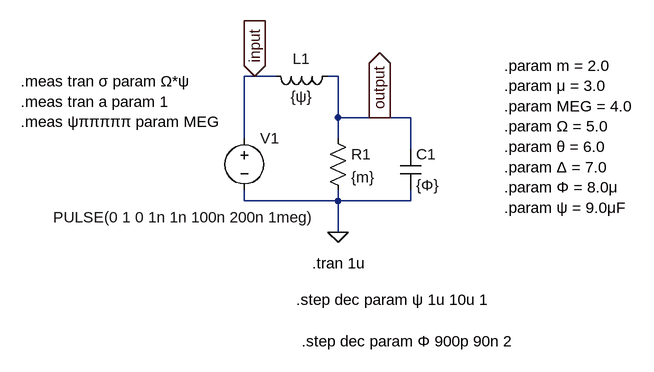
[diagram p0: schematic test17.asc]
test17.asc, the LTspice schematic file:
Version 4.1
SHEET 1 880 680
WIRE 112 48 96 48
WIRE 144 48 112 48
WIRE 240 48 224 48
WIRE 240 112 240 48
WIRE 304 112 240 112
WIRE 352 112 304 112
WIRE 96 144 96 48
WIRE 240 144 240 112
WIRE 352 160 352 112
WIRE 96 240 96 224
WIRE 240 240 240 224
WIRE 240 240 96 240
WIRE 352 240 352 224
WIRE 352 240 240 240
WIRE 240 288 240 240
FLAG 240 288 0
FLAG 112 48 input
IOPIN 112 48 In
FLAG 304 112 output
IOPIN 304 112 Out
SYMBOL voltage 96 128 R0
WINDOW 3 -294 137 Left 2
WINDOW 123 0 0 Left 2
WINDOW 39 0 0 Left 2
SYMATTR Value PULSE(0 1 0 1n 1n 100n 200n 1meg)
SYMATTR InstName V1
SYMBOL res 224 128 R0
SYMATTR InstName R1
SYMATTR Value {m}
SYMBOL cap 336 160 R0
SYMATTR InstName C1
SYMATTR Value {Φ}
SYMBOL ind 240 32 R90
WINDOW 0 5 56 VBottom 2
WINDOW 3 32 56 VTop 2
SYMATTR InstName L1
SYMATTR Value {ψ}
TEXT 200 336 Left 2 !.tran 1u
TEXT 496 32 Left 2 !.param m = 2.0\n.param μ = 3.0\n.param MEG = 4.0\n.param Ω = 5.0\n.param θ = 6.0\n.param Δ = 7.0\n.param Φ = 8.0μ\n.param ψ = 9.0μF
TEXT -248 56 Left 2 !.meas tran σ param Ω*ψ\n.meas tran a param 1\n.meas ψπππππ param MEG
TEXT 176 392 Left 2 !.step dec param ψ 1u 10u 1
TEXT 184 456 Left 2 !.step dec param Φ 900p 90n 2

The netlist it stands for:
* test17.asc
V1 input 0 PULSE(0 1 0 1n 1n 100n 200n 1meg)
R1 output 0 {m}
C1 output 0 {Φ}
L1 output input {ψ}
.tran 1u
.param m = 2.0
.param μ = 3.0
.param MEG = 4.0
.param Ω = 5.0
.param θ = 6.0
.param Δ = 7.0
.param Φ = 8.0μ
.param ψ = 9.0μF
.meas tran σ param Ω*ψ
.meas tran a param 1
.meas ψπππππ param MEG
.step dec param ψ 1u 10u 1
.step dec param Φ 900p 90n 2
.backanno
.end

* Results of the author's LTspice run, read from the files saved beside the schematic
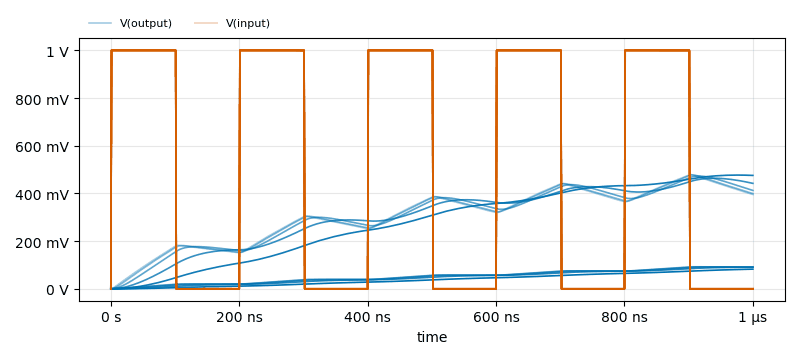
[diagram p1: Transient Analysis of test17.asc, plotted from the saved traces]
* Transient Analysis, 10 runs:
*   V(output) [ψ=1e-06 φ=9e-10]: min 0 V, max 478.9 mV, average 307.8 mV, rms 329.1 mV, last 395.5 mV
*   V(output) [ψ=1e-05 φ=9e-10]: min 0 V, max 92.4 mV, average 51.63 mV, rms 58.1 mV, last 90.7 mV
*   V(output) [ψ=1e-06 φ=2.84604989415154e-09]: min 0 V, max 477.7 mV, average 307.4 mV, rms 329 mV, last 399.4 mV
*   V(output) [ψ=1e-05 φ=2.84604989415154e-09]: min 0 V, max 92.29 mV, average 51.31 mV, rms 57.79 mV, last 90.84 mV
*   V(output) [ψ=1e-06 φ=9e-09]: min 0 V, max 473 mV, average 306.2 mV, rms 329 mV, last 412.5 mV
*   V(output) [ψ=1e-05 φ=9e-09]: min 0 V, max 91.95 mV, average 50.31 mV, rms 56.94 mV, last 91.25 mV
*   V(output) [ψ=1e-06 φ=2.84604989415154e-08]: min 0 V, max 463.7 mV, average 300.7 mV, rms 327.8 mV, last 442.2 mV
*   V(output) [ψ=1e-05 φ=2.84604989415154e-08]: min 0 V, max 90.84 mV, average 47.11 mV, rms 54.21 mV, last 90.84 mV
*   V(input) [ψ=1e-06 φ=9e-10]: min 0 V, max 1 V, average 505 mV, rms 709.6 mV, last 0 V
*   V(input) [ψ=1e-05 φ=9e-10]: min 0 V, max 1 V, average 504.9 mV, rms 709.5 mV, last 0 V
*   V(input) [ψ=1e-06 φ=2.84604989415154e-09]: min 0 V, max 1 V, average 505 mV, rms 709.6 mV, last 0 V
*   V(input) [ψ=1e-05 φ=2.84604989415154e-09]: min 0 V, max 1 V, average 505 mV, rms 709.6 mV, last 0 V
*   V(input) [ψ=1e-06 φ=9e-09]: min 0 V, max 1 V, average 505 mV, rms 709.6 mV, last 0 V
*   V(input) [ψ=1e-05 φ=9e-09]: min 0 V, max 1 V, average 505 mV, rms 709.6 mV, last 0 V
*   V(input) [ψ=1e-06 φ=2.84604989415154e-08]: min 0 V, max 1 V, average 505 mV, rms 709.7 mV, last 0 V
*   V(input) [ψ=1e-05 φ=2.84604989415154e-08]: min 0 V, max 1 V, average 505 mV, rms 709.9 mV, last 0 V
* From the log:
*   Measurement: σ
*     step  Ω*ψ
*        1  5e-06
*        2  5e-05
*        3  5e-06
*        4  5e-05
*        5  5e-06
*        6  5e-05
*        7  5e-06
*        8  5e-05
*        9  5e-06
*       10  5e-05
*   Measurement: a
*     step  1
*        1  1
*        2  1
*        3  1
*        4  1
*        5  1
*        6  1
*        7  1
*        8  1
*        9  1
*       10  1
*   Measurement: ψπππππ
*     step  MEG
*        1  4
*        2  4
*        3  4
*        4  4
*        5  4
*        6  4
*        7  4
*        8  4
*        9  4
*       10  4